# Altium project MTG_Bainarry_Main_PCB.PrjPcb
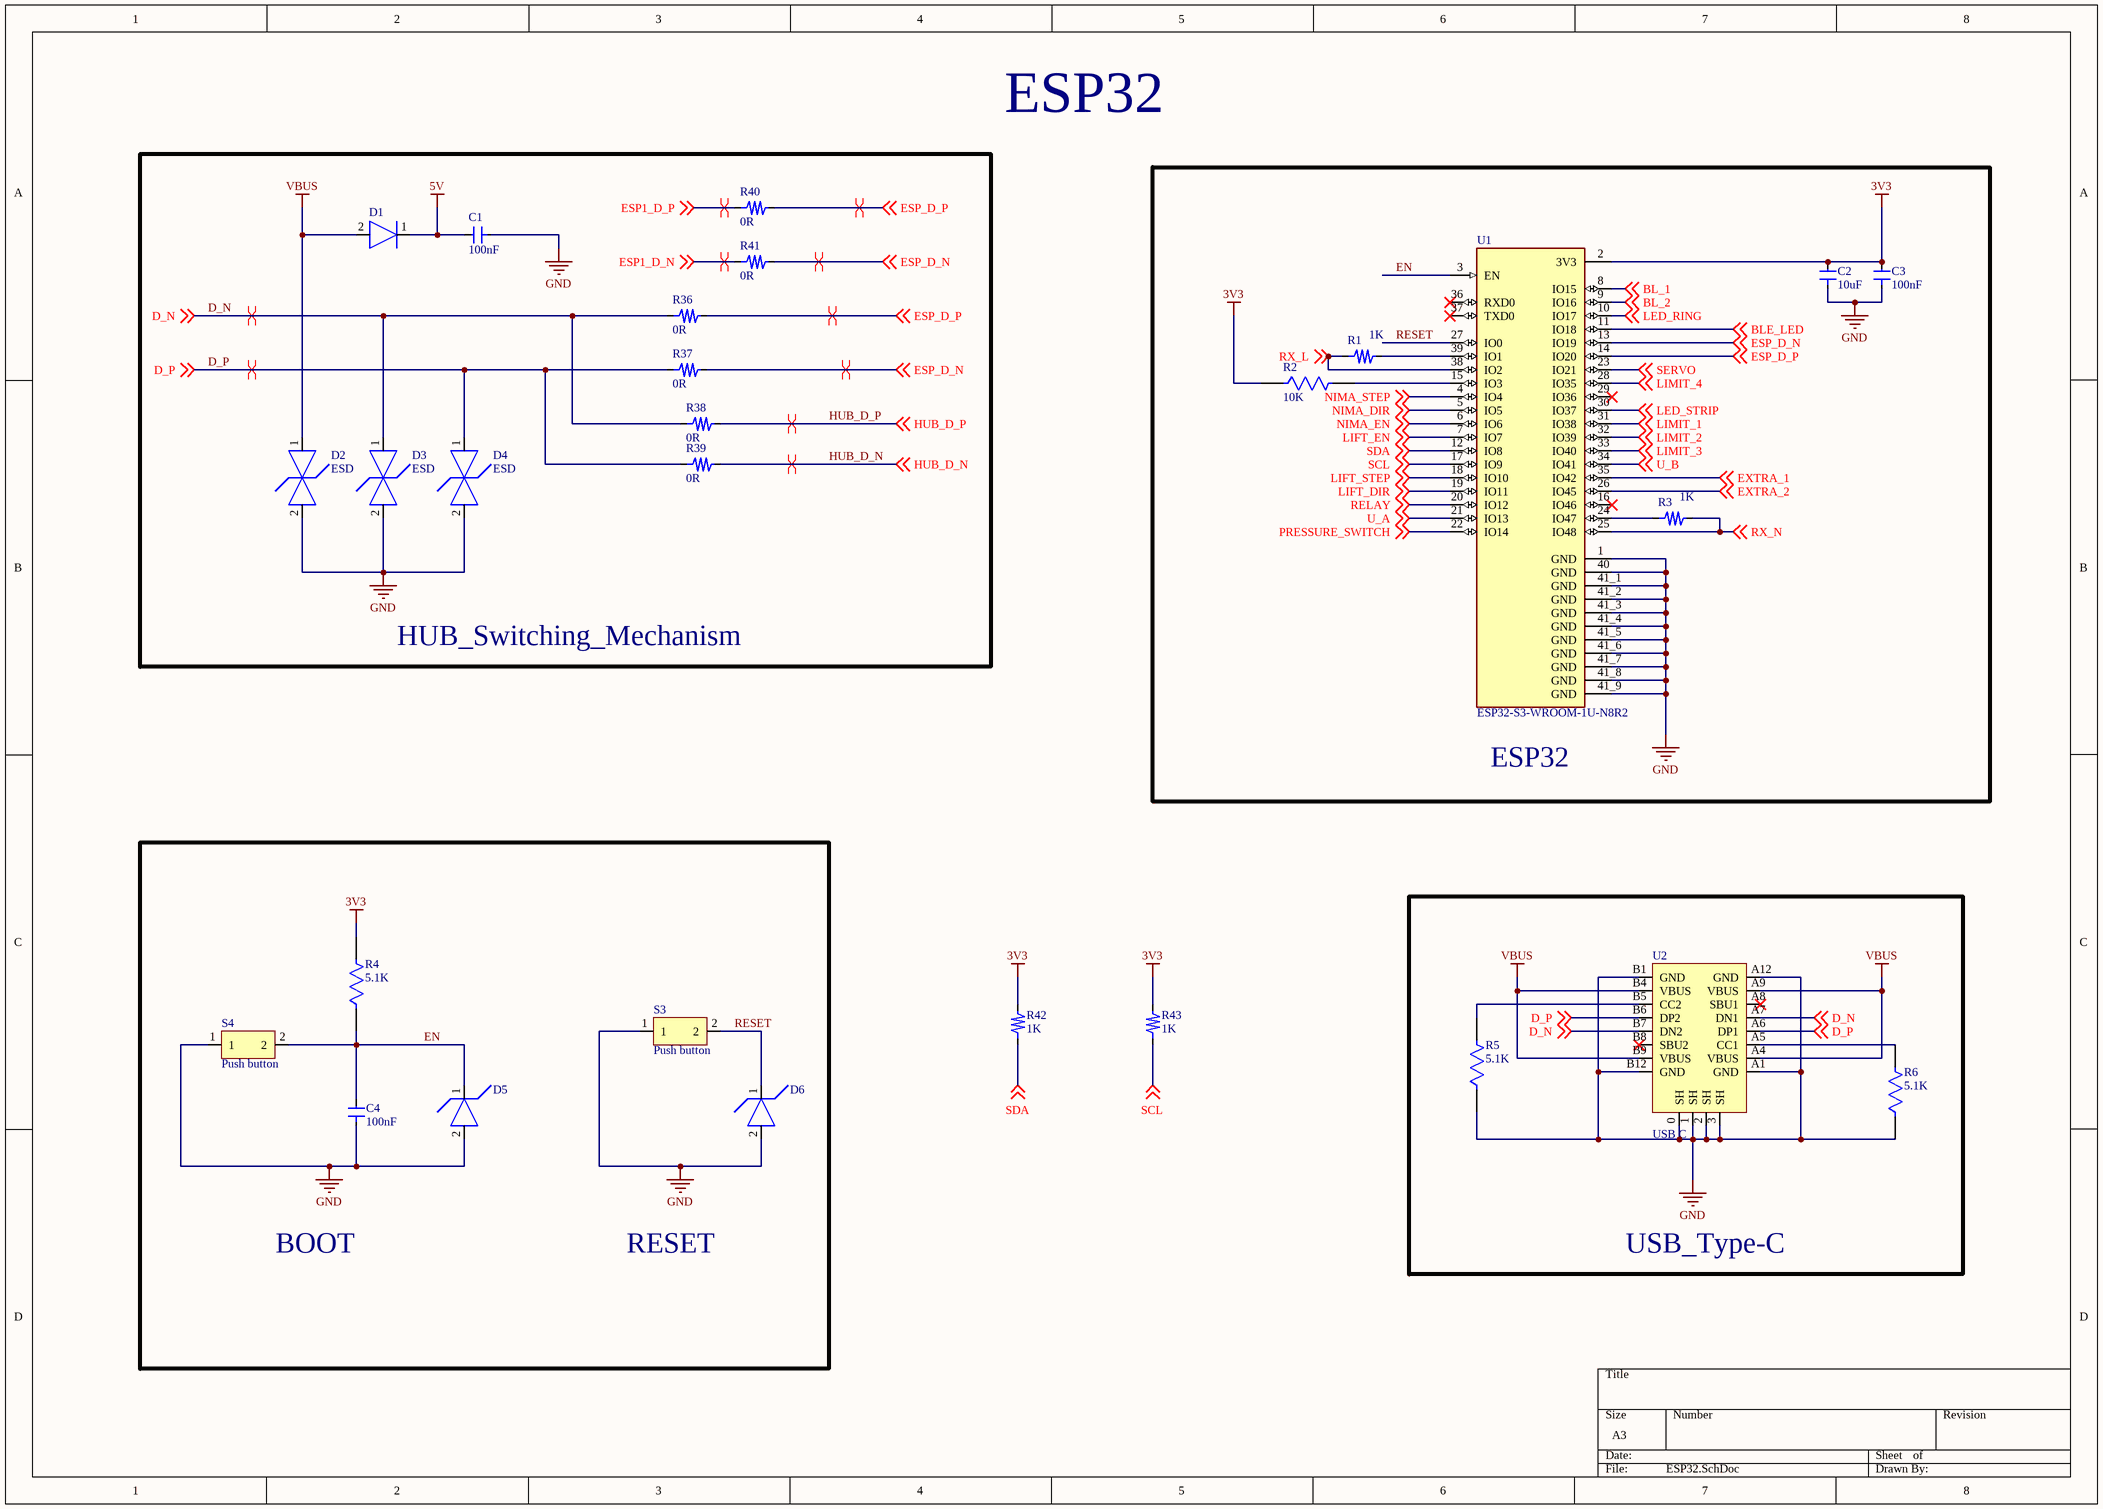
[diagram p0: ESP32.SchDoc]
7 sheets, 115 parts. Net scope: global (net labels, ports and power ports of the same name join across sheets).
Board file: MTG_B_MAIN.PcbDoc
Sheets:
  ESP32.SchDoc
  XIAO_S3.SchDoc
  MOTOR_DRIVERS.SchDoc
  USB_HUB.SchDoc
  REALY_AND_PRESSURE.SchDoc
  CONNECTORS.SchDoc
  Power.SchDoc

## Sheet ESP32.SchDoc
size A3; SheetNumber: 1; SheetTotal: 7

### Parts
C1  100nF  [CAP 0603]
C2  10uF  [CAP 0603]
C3  100nF  [CAP 0603]
C4  100nF  [CAP 0603]
D1  Diode  [Dioad]  (value not drawn)
D2  ESD  [ESD]
D3  ESD  [ESD]
D4  ESD  [ESD]
D5  SINGAL ESD  [Singal ESD]  (value not drawn)
D6  SINGAL ESD  [Singal ESD]  (value not drawn)
R1  1K  [RES 0603]
R2  10K  [RES 0603]
R3  1K  [RES 0603]
R4  5.1K  [RES 0603]
R5  5.1K  [RES 0603]
R6  5.1K  [RES 0603]
R36  0R  [RES_0201]
R37  0R  [RES_0201]
R38  0R  [RES_0201]
R39  0R  [RES_0201]
R40  0R  [RES_0201]
R41  0R  [RES_0201]
R42  1K  [RES 0603]
R43  1K  [RES 0603]
S3  Push button  [Tactical Switch]
S4  Push button  [Tactical Switch]
U1  ESP32-S3-WROOM-1U-N8R2  [XCVR_ESP32-S3-WROOM-1U-N8R2]
U2  USB C  [TYPE-C]

### Blocks framed on the sheet
HUB_Switching_Mechanism: C1 D1-D4 R36-R41
ESP32: C2 C3 R1-R3 U1
USB_Type-C: R5 R6 U2

### Nets
3V3: C2.2 C3.2 R2.1 R4.2 R42.2 R43.2 U1.2(3V3)
5V: C1.2 D1.1
GND: C1.1 C2.1 C3.1 C4.1 D2.2 D3.2 D4.2 D5.2 D6.2 R5.1 R6.1 S3.1 S4.1 U1.1(GND) U1.40(GND) U1.41_1(GND) U1.41_2(GND) U1.41_3(GND) U1.41_4(GND) U1.41_5(GND) U1.41_6(GND) U1.41_7(GND) U1.41_8(GND) U1.41_9(GND) U2.0(SH) U2.1(SH) U2.2(SH) U2.3(SH) U2.A1(GND) U2.A12(GND) U2.B1(GND) U2.B12(GND)
VBUS: D1.2 D2.1 U2.A4(VBUS) U2.A9(VBUS) U2.B4(VBUS) U2.B9(VBUS)
BL_1: U1.8(IO15) ; off-sheet BL_1
BL_2: U1.9(IO16) ; off-sheet BL_2
BLE_LED: U1.11(IO18) ; off-sheet BLE_LED
D_N: D3.1 R36.1 R38.1 U2.A7(DN1) U2.B7(DN2) ; off-sheet D_N
D_P: D4.1 R37.1 R39.1 U2.A6(DP1) U2.B6(DP2) ; off-sheet D_P
EN: C4.2 D5.1 R4.1 S4.2 U1.3(EN)
ESP1_D_N: R41.1 ; off-sheet ESP1_D_N
ESP1_D_P: R40.1 ; off-sheet ESP1_D_P
ESP_D_N: R37.2 R41.2 U1.13(IO19) ; off-sheet ESP_D_N
ESP_D_P: R36.2 R40.2 U1.14(IO20) ; off-sheet ESP_D_P
EXTRA_1: U1.35(IO42) ; off-sheet EXTRA_1
EXTRA_2: U1.26(IO45) ; off-sheet EXTRA_2
HUB_D_N: R39.2 ; off-sheet HUB_D_N
HUB_D_P: R38.2 ; off-sheet HUB_D_P
LED_RING: U1.10(IO17) ; off-sheet LED_RING
LED_STRIP: U1.30(IO37) ; off-sheet LED_STRIP
LIFT_DIR: U1.19(IO11) ; off-sheet LIFT_DIR
LIFT_EN: U1.7(IO7) ; off-sheet LIFT_EN
LIFT_STEP: U1.18(IO10) ; off-sheet LIFT_STEP
LIMIT_1: U1.31(IO38) ; off-sheet LIMIT_1
LIMIT_2: U1.32(IO39) ; off-sheet LIMIT_2
LIMIT_3: U1.33(IO40) ; off-sheet LIMIT_3
LIMIT_4: U1.28(IO35) ; off-sheet LIMIT_4
NIMA_DIR: U1.5(IO5) ; off-sheet NIMA_DIR
NIMA_EN: U1.6(IO6) ; off-sheet NIMA_EN
NIMA_STEP: U1.4(IO4) ; off-sheet NIMA_STEP
PRESSURE_SWITCH: U1.22(IO14) ; off-sheet PRESSURE_SWITCH
RELAY: U1.20(IO12) ; off-sheet RELAY
RESET: D6.1 S3.2 U1.27(IO0)
RX_L: R1.1 U1.38(IO2) ; off-sheet RX_L
RX_N: R3.2 U1.25(IO48) ; off-sheet RX_N
SCL: R43.1 U1.17(IO9) ; off-sheet SCL
SDA: R42.1 U1.12(IO8) ; off-sheet SDA
SERVO: U1.23(IO21) ; off-sheet SERVO
U_A: U1.21(IO13) ; off-sheet U_A
U_B: U1.34(IO41) ; off-sheet U_B
NetR1_2: R1.2 U1.39(IO1)
NetR2_2: R2.2 U1.15(IO3)
NetR3_1: R3.1 U1.24(IO47)
NetR5_2: R5.2 U2.B5(CC2)
NetR6_2: R6.2 U2.A5(CC1)

Not connected (* = marked no-connect by the designer): U1 16(IO46)* 29(IO36)* 36(RXD0)* 37(TXD0)*; U2 A8(SBU1)* B8(SBU2)*

### Layout directives
differential pair: D_N, D_P, ESP1_D_N, ESP1_D_P, ESP_D_N, ESP_D_P, HUB_D_N, HUB_D_P

### Notes on the sheet
- ESP32
- BOOT
- RESET

### Library data of the parts
C1 C3 C4 = Capasitor: Part Number: CC0603JRX7R9BB104; Manufacture: YAGEO; Footprint size: 0603; ComponentLink1Description: New link; ComponentLink1URL: *; Supplier: LCSC; Supplier Part Number: C91183; Link: https://www.lcsc.com/product-detail/C91183.html
C2 = Capasitor: Part Number: CC0603KRX5R5BB106; Manufacture: YAGEO; Footprint size: 0603; ComponentLink1Description: New link; ComponentLink1URL: *; Supplier: LCSC; Supplier Part Number: C109455; Link: https://www.lcsc.com/product-detail/C109455.html
D1 = Diode: Manufacture: Guangdong Hottech; Part Number: 1N5819WS; Footprint size: SOD-323; Supplier Part Number: C191023; Supplier: LCSC; Link: https://www.lcsc.com/product-detail/C191023.html?s_z=n_1N5819WS
D2-D4 = ESD: Manufacture: UMW; Part Number: LESD5D5.0CT1G(UMW); Footprint size: SOD-523; Supplier: LCSC; Supplier Part Number: C5199850; Link: https://www.lcsc.com/product-detail/C5199850.html?s_z=n_LESD5D5.0CT1G
D5 D6 = SINGAL ESD: Manufacture: onsemi; Part Number: ESD5Z3.3T1G; Footprint size: SOD-523; Supplier: LCSC; Supplier Part Number: C61148; Link: https://www.lcsc.com/product-detail/C61148.html?s_z=n_ESD5Z3.3T1G
R1 R3 = Resistor: Manufacture: RESI; Part Number: AECR0603F1K00K9; Footprint size: 0603; ComponentLink1Description: New link; ComponentLink1URL: *; Supplier: LCSC; Supplier Part Number: C328340; Link: https://www.lcsc.com/product-detail/C328340.html?spm=wm.fly.bg.0.xh&lcsc_vid=RFYMBlMFQAQLUVJeFVJZXwVeRFYIAgBXEVkPUlxRRVUxVlNRQFNWUFJUQFldUjsOAxUeFF5JWBYZEEoKFBINSQcJGk4eFQsCAgIaSgADAwAHC0slQllXU1RIHxUDCw%3D%3D
R2 = R NEW: Manufacture: YAGEO; Part Number: RC0603JR-0710KL; Footprint size: 0603; ComponentLink1Description: New link; ComponentLink1URL: *; Supplier: LCSC; Supplier Part Number: C99198; Link: https://www.lcsc.com/product-detail/C99198.html
R4-R6 = R NEW: Manufacture: YAGEO; Part Number: RC0603JR-075K1L; Footprint size: 0603; ComponentLink1Description: New link; ComponentLink1URL: *; Supplier: LCSC; Supplier Part Number: C14677; Link: https://www.lcsc.com/product-detail/C14677.html
R36-R41 = Resistor: Manufacture: YAGEO; Part Number: RC0201FR-070RL; Footprint size: 0201; ComponentLink1Description: New link; ComponentLink1URL: *; Supplier: LCSC; Supplier Part Number: C106227; Link: https://www.lcsc.com/product-detail/C106227.html?s_z=n_q_C106227
R42 R43 = Resistor: Manufacture: YAGEO; Part Number: RC0603FR-074K7L; Footprint size: 0603; ComponentLink1Description: New link; ComponentLink1URL: *; Supplier: LCSC; Supplier Part Number: C99782; Link: https://www.lcsc.com/product-detail/C99782.html?spm=wm.fly.bg.0.xh___wm.sxq.dhl.mly.12-6-1&lcsc_vid=RFYMBlMFQAQLUVJeFVJZXwVeRFYIAgBXEVkPUlxRRVUxVlNRT1NdV1xeQ1FZVzsOAxUeFF5JWBYZEEoKFBINSQcJGk4eFQsCAgIaSgADAwAHC0slQ1hbUldfWQkaCgg%3D
S3 S4 = Push button: Manufacture: G-Switch; Part Number: GT-TC060A-H025-L1S; Footprint size: SMD,6x3mm; Supplier: LCSC; Supplier Part Number: C7450623; Link: https://www.lcsc.com/product-detail/C7450623.html
U1 = ESP32-S3-WROOM-1U-N8R2: Bluetooth, WiFi 802.11b/g/n, Bluetooth v5.0 Transceiver Module 2.4GHz Antenna Not Included, U.FL Surface Mount; Manufacture: ESPRESSIF; Part Number: ESP32-S3-WROOM-1U-N8R2; Footprint size: SMD,19.2x18mm; Supplier: LCSC; Supplier Part Number: C3013944; Link: https://www.lcsc.com/product-detail/C3013944.html?s_z=n_q_ESP32-S3-WROOM-1U-N8R2&spm=wm.ssy.bg.0.xh&lcsc_vid=RFYMBlMFQAQLUVJeFVJZXwVeRFYIAgBXEVkPUlxRRVUxVlNRQFVaU1JRR1hdUzsOAxUeFF5JWBYZEEoKFBINSQcJGk4eFQsCAgIaSgADAwAHC0slQ1hbUldfWQkaCgg%3D
U2 = USB C: Manufacture: DEALON; Part Number: USB-TYPE-C-018; Footprint size: SMD; Supplier: LCSC; Supplier Part Number: C2927038; Link: https://www.lcsc.com/product-detail/C2927038.html?s_z=n_q_C2927038&globalKeyword=C2927038

## Sheet XIAO_S3.SchDoc
size A4; SheetNumber: 2; SheetTotal: 7
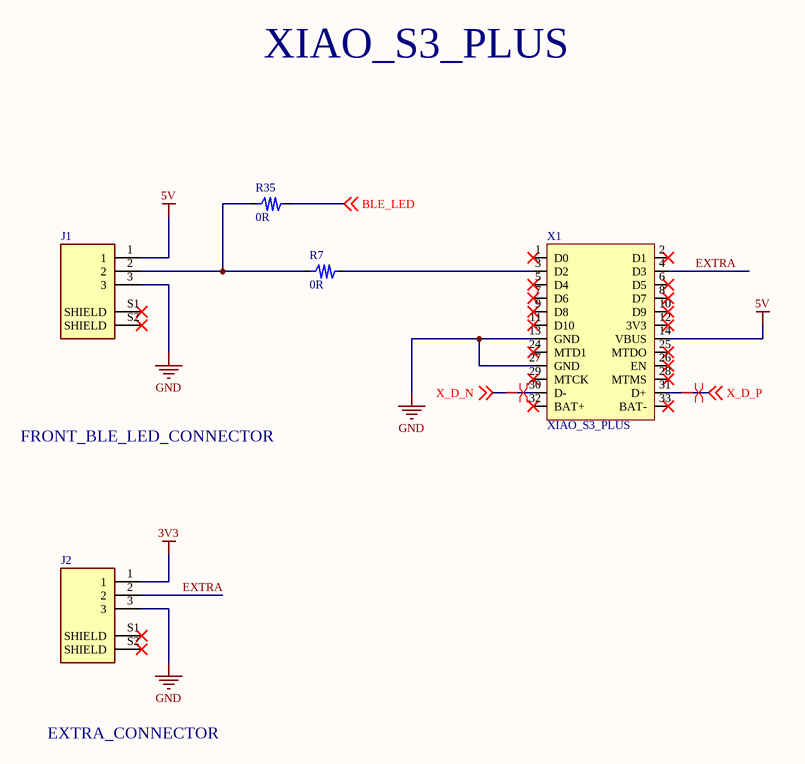
[diagram p1: XIAO_S3.SchDoc]

### Parts
J1  SM03B-SRSS-TB(LF)(SN)  [JST_SM03B-SRSS-TB(LF)(SN)]  (value not drawn)
J2  SM03B-SRSS-TB(LF)(SN)  [JST_SM03B-SRSS-TB(LF)(SN)]  (value not drawn)
R7  0R  [RES 0603]
R35  0R  [RES 0603]
X1  XIAO_S3_PLUS  [XIAO_S3_PLUS]

### Nets
3V3: J2.1
5V: J1.1 X1.14(VBUS)
GND: J1.3 J2.3 X1.13(GND) X1.27(GND)
BLE_LED: R35.2 ; off-sheet BLE_LED
EXTRA: J2.2 X1.4(D3)
X_D_N: X1.30(D-) ; off-sheet X_D_N
X_D_P: X1.31(D+) ; off-sheet X_D_P
NetJ1_2: J1.2 R7.1 R35.1
NetR7_2: R7.2 X1.3(D2)

Not connected (* = marked no-connect by the designer): J1 S1(SHIELD)* S2(SHIELD)*; J2 S1(SHIELD)* S2(SHIELD)*; X1 1(D0)* 2(D1)* 5(D4)* 6(D5)* 7(D6)* 8(D7)* 9(D8)* 10(D9)* 11(D10)* 12(3V3)* 24(MTD1)* 25(MTDO)* 26(EN)* 28(MTMS)* 29(MTCK)* 32(BAT+)* 33(BAT-)*

### Layout directives
differential pair: X_D_N, X_D_P

### Notes on the sheet
- XIAO_S3_PLUS
- FRONT_BLE_LED_CONNECTOR
- EXTRA_CONNECTOR

### Library data of the parts
J1 J2 = SM03B-SRSS-TB(LF)(SN): Connector Header Surface Mount, Right Angle 3 position 0.039 (1.00mm); Manufacture: JST; Part Number: SM03B-SRSS-TB(LF)(SN); Footprint size: SMD,P=1mm,Surface Mount,Right Angle; Supplier: LCSC; Supplier Part Number: C160403
  J1: Link: https://www.lcsc.com/product-detail/C160403.html?s_z=n_q_SM03B-SRSS-TB%2520%28LF%29%28SN%29&spm=wm.ssy.bg.0.xh&lcsc_vid=RFYMBlMFQAQLUVJeFVJZXwVeRFYIAgBXEVkPUlxRRVUxVlNRT1FYV1xXRVRYUjsOAxUeFF5JWBYZEEoKFBINSQcJGk4eFQsCAgIaSgADAwAHC0slRldeVFFSWQkaCgg%3D
  J2: Link: https://www.lcsc.com/product-detail/C160403.html?s_z=n_q_SM03B-SRSS-TB%2520%28LF%29%28SN%29&spm=wm.ssy.bg.0.xh&lcsc_vid=RFYMBlMFQAQLUVJeFVJZXwVeRFYIAgBXEVkPUlxRRVUxVlNRT1FbVVBSRFBeUjsOAxUeFF5JWBYZEEoKFBINSQcJGk4%3D
R7 R35 = Resistor: Manufacture: YAGEO; Part Number: RC0603JR-070RL; Footprint size: 0603; ComponentLink1Description: New link; ComponentLink1URL: *; Supplier: LCSC; Supplier Part Number: C95177; Link: https://www.lcsc.com/product-detail/C95177.html?spm=wm.fly.bg.0.xh___wm.sy.top.tjl.8-58&lcsc_vid=EwNbUgICTlRcBlxXEQRYAgYAFVkLVwZURVRZBVcDFVcxVlNRQVhdXlVXT1hfVjsOAxUeFF5JWBYZEEoBGA4JCwFIFA4DSA%3D%3D

## Sheet MOTOR_DRIVERS.SchDoc
size A4; SheetNumber: 3; SheetTotal: 7
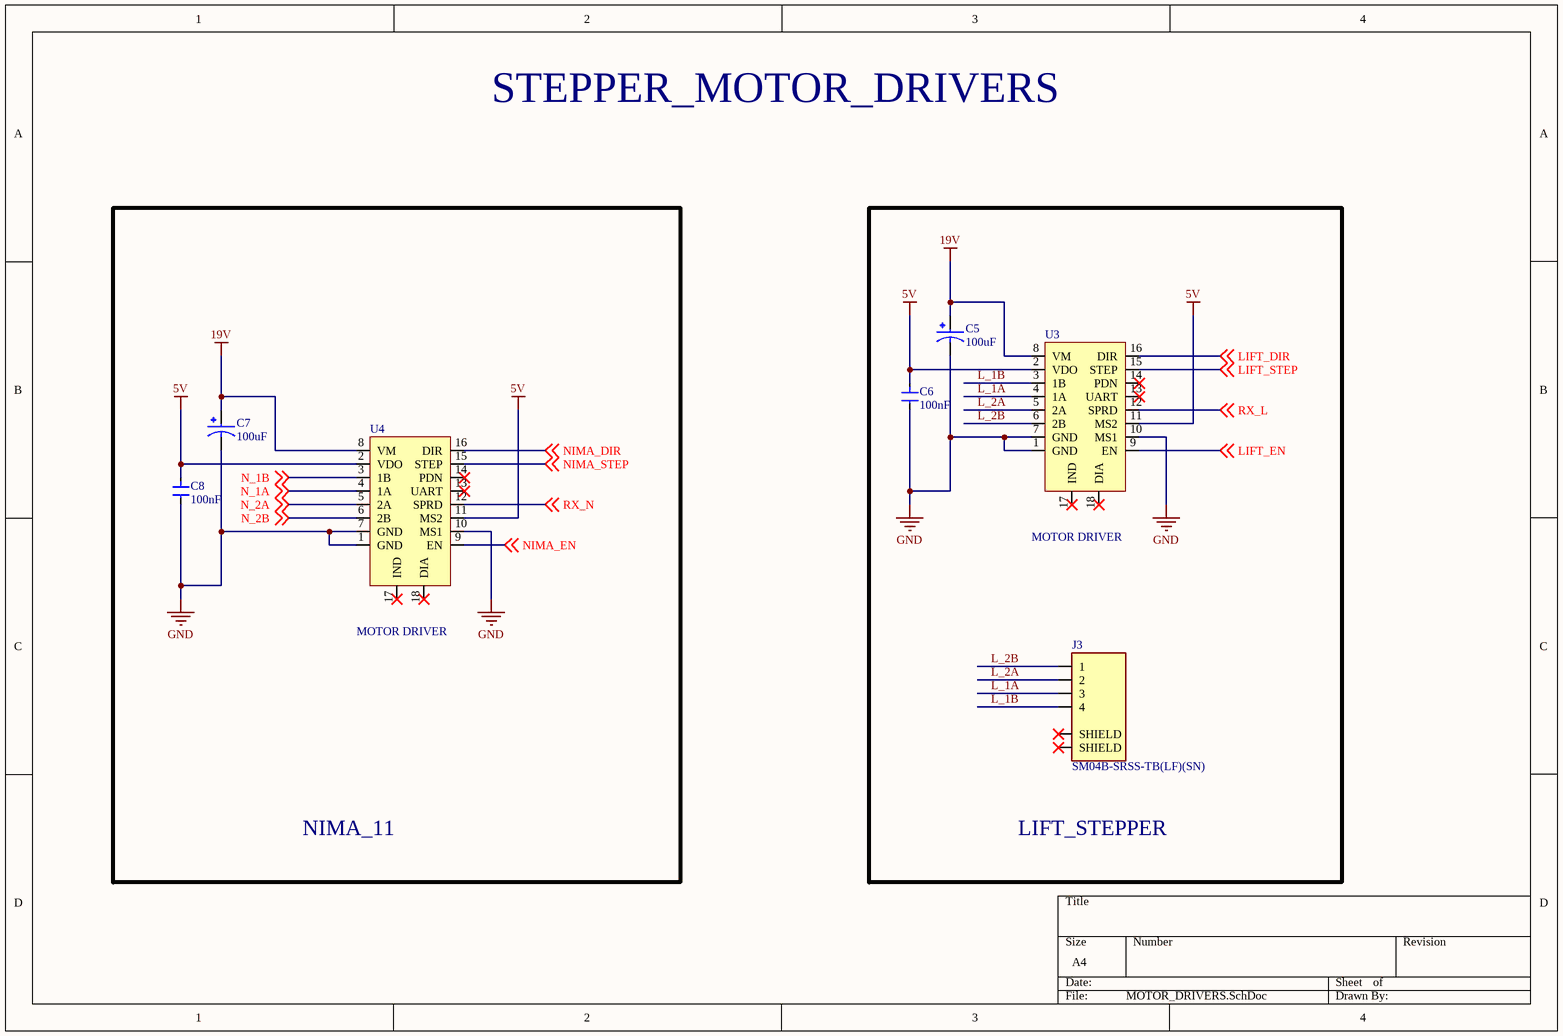
[diagram p2: MOTOR_DRIVERS.SchDoc]

### Parts
C5  100uF  [CAP_EEEFTH101XAP]
C6  100nF  [CAP 0603]
C7  100uF  [CAP_EEEFTH101XAP]
C8  100nF  [CAP 0603]
J3  SM04B-SRSS-TB(LF)(SN)  [CONN-TH_B4B-PH-K-S]
U3  MOTOR DRIVER  [MOTOR DRIVER]
U4  MOTOR DRIVER  [MOTOR DRIVER]

### Blocks framed on the sheet
NIMA_11: C7 C8 U4
LIFT_STEPPER: C5 C6 J3 U3

### Nets
5V: C6.1 C8.1 U3.2(VDO) U3.11(MS2) U4.2(VDO) U4.11(MS2)
19V: C5.1 C7.1 U3.8(VM) U4.8(VM)
GND: C5.2 C6.2 C7.2 C8.2 U3.1(GND) U3.7(GND) U3.10(MS1) U4.1(GND) U4.7(GND) U4.10(MS1)
L_1A: J3.3 U3.4(1A)
L_1B: J3.4 U3.3(1B)
L_2A: J3.2 U3.5(2A)
L_2B: J3.1 U3.6(2B)
LIFT_DIR: U3.16(DIR) ; off-sheet LIFT_DIR
LIFT_EN: U3.9(EN) ; off-sheet LIFT_EN
LIFT_STEP: U3.15(STEP) ; off-sheet LIFT_STEP
N_1A: U4.4(1A) ; off-sheet N_1A
N_1B: U4.3(1B) ; off-sheet N_1B
N_2A: U4.5(2A) ; off-sheet N_2A
N_2B: U4.6(2B) ; off-sheet N_2B
NIMA_DIR: U4.16(DIR) ; off-sheet NIMA_DIR
NIMA_EN: U4.9(EN) ; off-sheet NIMA_EN
NIMA_STEP: U4.15(STEP) ; off-sheet NIMA_STEP
RX_L: U3.12(SPRD) ; off-sheet RX_L
RX_N: U4.12(SPRD) ; off-sheet RX_N

Not connected (* = marked no-connect by the designer): J3 S1(SHIELD)* S2(SHIELD)*; U3 13(UART)* 14(PDN)* 17(IND)* 18(DIA)*; U4 13(UART)* 14(PDN)* 17(IND)* 18(DIA)*

### Notes on the sheet
- STEPPER_MOTOR_DRIVERS

### Library data of the parts
C5 C7 = EEEFTH101XAP: 100ÂµF 50V Aluminum Electrolytic Capacitors Radial, Can - SMD 340mOhm @ 100kHz 2000 Hrs @ 105Â°C; Manufacture: PANASONIC; Part Number: EEEFTH101XAP; Footprint size: SMD,D6.3xL7.7mm; Supplier: LCSC; Supplier Part Number: C165974; Link: https://www.lcsc.com/product-detail/C165974.html?spm=wm.fly.bg.0.xh___wm.fly.tp.1.ml&lcsc_vid=RFYMBlMFQAQLUVJeFVJZXwVeRFYIAgBXEVkPUlxRRVUxVlNRQVleUVNURlVfUDsOAxUeFF5JWBYZEEoKFBINSQcJGk4NBhADEA4cHktXRlVcSQwSGg0%3D
C6 C8 = Capasitor: as C1 on sheet ESP32; Footprint size: 0603; ComponentLink1Description: New link; ComponentLink1URL: *; Supplier: LCSC; Supplier Part Number: C91183; Link: https://www.lcsc.com/product-detail/C91183.html
J3 = SM04B-SRSS-TB(LF)(SN): Connector Header Surface Mount, Right Angle 4 position 0.039 (1.00mm); Manufacture: JST; Part Number: B4B-PH-K-S(LF)(SN); Footprint size: Through Hole,P=2mm; Supplier: LCSC; Supplier Part Number: C131334; Link: https://www.lcsc.com/product-detail/C131334.html?spm=wm.fly.bg.0.xh___wm.sxq.ssx.dcs.1&lcsc_vid=RFYMBlMFQAQLUVJeFVJZXwVeRFYIAgBXEVkPUlxRRVUxVlNRT1FbVVBSRFBeUjsOAxUeFF5JWBYZEEoKFBINSQcJGk4%3D

## Sheet USB_HUB.SchDoc
size A4; SheetNumber: 4; SheetTotal: 7
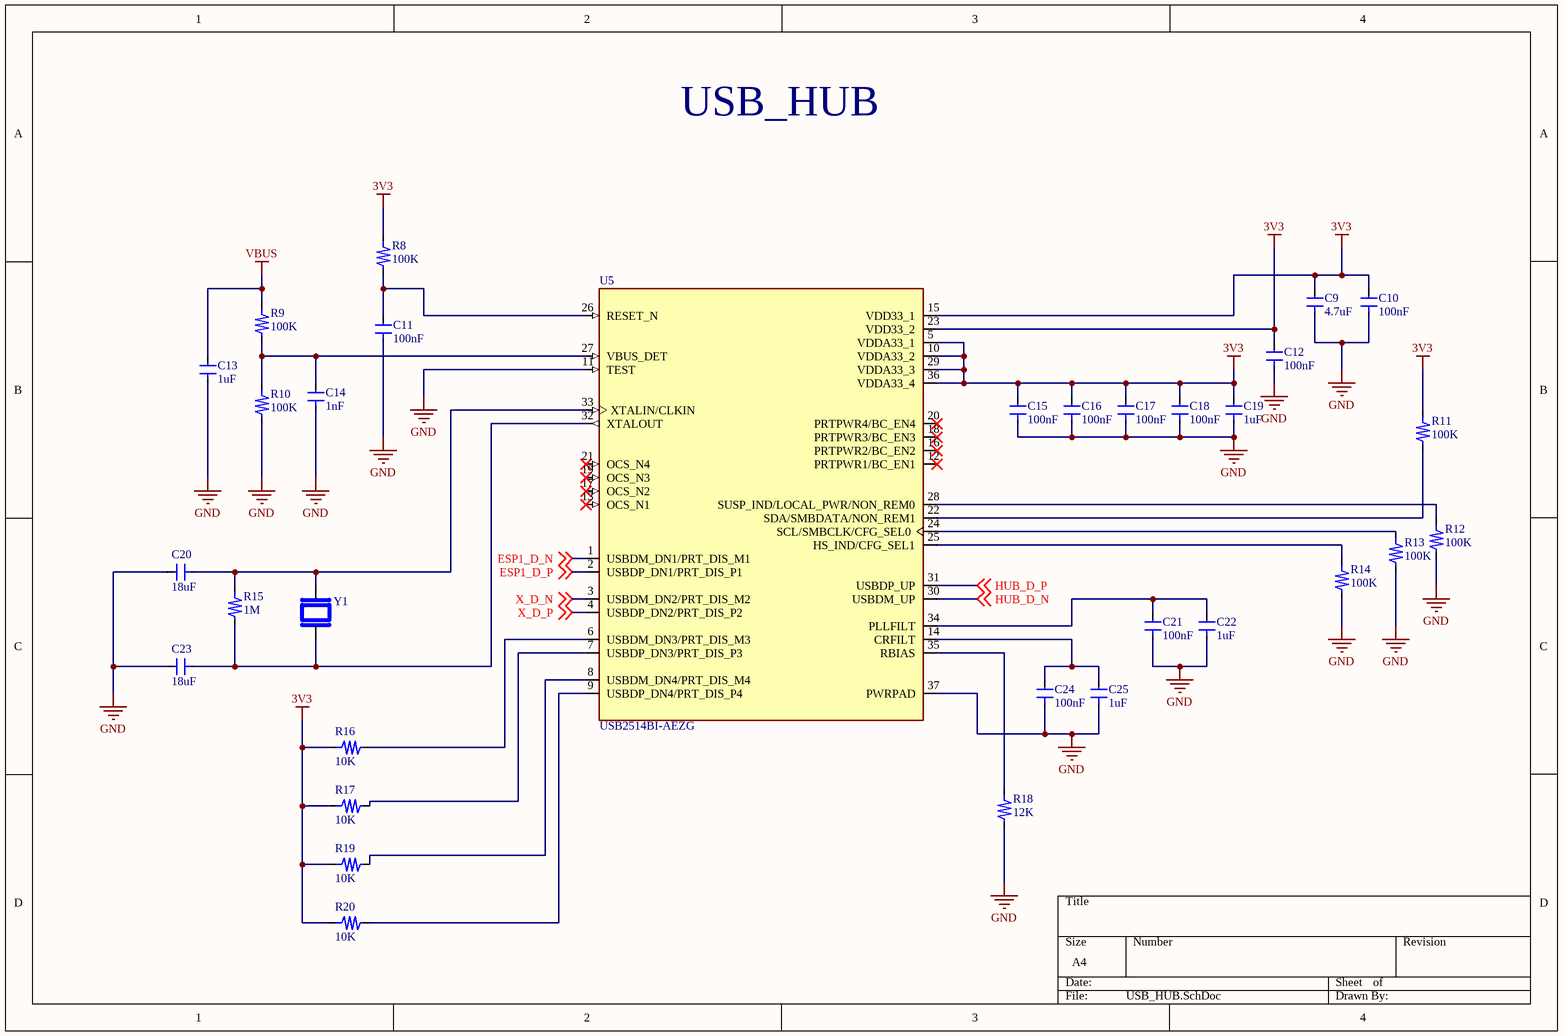
[diagram p3: USB_HUB.SchDoc]

### Parts
C9  4.7uF  [CAP 0603]
C10  100nF  [CAP 0603]
C11  100nF  [CAP 0603]
C12  100nF  [CAP 0603]
C13  1uF  [CAP 0603]
C14  1nF  [CAP 0603]
C15  100nF  [CAP 0603]
C16  100nF  [CAP 0603]
C17  100nF  [CAP 0603]
C18  100nF  [CAP 0603]
C19  1uF  [CAP 0603]
C20  18uF  [CAP 0603]
C21  100nF  [CAP 0603]
C22  1uF  [CAP 0603]
C23  18uF  [CAP 0603]
C24  100nF  [CAP 0603]
C25  1uF  [CAP 0603]
R8  100K  [RES 0603]
R9  100K  [RES 0603]
R10  100K  [RES 0603]
R11  100K  [RES 0603]
R12  100K  [RES 0603]
R13  100K  [RES 0603]
R14  100K  [RES 0603]
R15  1M  [RES 0603]
R16  10K  [RES 0603]
R17  10K  [RES 0603]
R18  12K  [RES 0603]
R19  10K  [RES 0603]
R20  10K  [RES 0603]
U5  USB2514BI-AEZG  [QFN50P600X600X100-37N]
Y1  ABLS-24.000MHZ-B4-T  [XTAL_ABLS-24.000MHZ-B4-T]  (value not drawn)

### Nets
3V3: C9.2 C10.2 C12.2 C15.2 C16.2 C17.2 C18.2 C19.2 R8.1 R11.1 R16.1 R17.1 R19.1 R20.1 U5.5(VDDA33_1) U5.10(VDDA33_2) U5.15(VDD33_1) U5.23(VDD33_2) U5.29(VDDA33_3) U5.36(VDDA33_4)
GND: C9.1 C10.1 C11.1 C12.1 C13.1 C14.1 C15.1 C16.1 C17.1 C18.1 C19.1 C20.2 C21.1 C22.1 C23.2 C24.1 C25.1 R10.2 R12.2 R13.2 R14.2 R18.2 U5.11(TEST) U5.37(PWRPAD)
VBUS: C13.2 R9.1
ESP1_D_N: U5.1(USBDM_DN1/PRT_DIS_M1) ; off-sheet ESP1_D_N
ESP1_D_P: U5.2(USBDP_DN1/PRT_DIS_P1) ; off-sheet ESP1_D_P
HUB_D_N: U5.30(USBDM_UP) ; off-sheet HUB_D_N
HUB_D_P: U5.31(USBDP_UP) ; off-sheet HUB_D_P
X_D_N: U5.3(USBDM_DN2/PRT_DIS_M2) ; off-sheet X_D_N
X_D_P: U5.4(USBDP_DN2/PRT_DIS_P2) ; off-sheet X_D_P
NetC11_2: C11.2 R8.2 U5.26(RESET_N)
NetC14_2: C14.2 R9.2 R10.1 U5.27(VBUS_DET)
NetC20_1: C20.1 R15.1 U5.33(XTALIN/CLKIN) Y1.2
NetC21_2: C21.2 C22.2 U5.34(PLLFILT)
NetC23_1: C23.1 R15.2 U5.32(XTALOUT) Y1.1
NetC24_2: C24.2 C25.2 U5.14(CRFILT)
NetR11_2: R11.2 U5.22(SDA/SMBDATA/NON_REM1)
NetR12_1: R12.1 U5.28(SUSP_IND/LOCAL_PWR/NON_REM0)
NetR13_1: R13.1 U5.24(SCL/SMBCLK/CFG_SEL0)
NetR14_1: R14.1 U5.25(HS_IND/CFG_SEL1)
NetR16_2: R16.2 U5.6(USBDM_DN3/PRT_DIS_M3)
NetR17_2: R17.2 U5.7(USBDP_DN3/PRT_DIS_P3)
NetR18_1: R18.1 U5.35(RBIAS)
NetR19_2: R19.2 U5.8(USBDM_DN4/PRT_DIS_M4)
NetR20_2: R20.2 U5.9(USBDP_DN4/PRT_DIS_P4)

Not connected (* = marked no-connect by the designer): U5 12(PRTPWR1/BC_EN1)* 13(OCS_N1)* 16(PRTPWR2/BC_EN2)* 17(OCS_N2)* 18(PRTPWR3/BC_EN3)* 19(OCS_N3)* 20(PRTPWR4/BC_EN4)* 21(OCS_N4)*

### Notes on the sheet
- USB_HUB

### Library data of the parts
C9 = Capasitor: Part Number: CL10A475KL8NRNC; Manufacture: Samsung Electro-Mechanics; Footprint size: 0603; ComponentLink1Description: New link; ComponentLink1URL: *; Supplier: LCSC; Supplier Part Number: C307467; Link: https://www.lcsc.com/product-detail/C307467.html?spm=wm.fly.bg.0.xh&lcsc_vid=RFYMBlMFQAQLUVJeFVJZXwVeRFYIAgBXEVkPUlxRRVUxVlNRQFNWU1xXQ1FYVTsOAxUeFF5JWBYZEEoKFBINSQcJGk4NBhADEA4cHktXRlVcSQwSGg0%3D
C10-C12 C15-C18 C21 C24 = Capasitor: as C1 on sheet ESP32; Footprint size: 0603; ComponentLink1Description: New link; ComponentLink1URL: *; Supplier: LCSC; Supplier Part Number: C91183; Link: https://www.lcsc.com/product-detail/C91183.html?spm=wm.fly.bg.0.xh&lcsc_vid=RFYMBlMFQAQLUVJeFVJZXwVeRFYIAgBXEVkPUlxRRVUxVlNRQFNZUlZTRldbXzsOAxUeFF5JWBYZEEoKFBINSQcJGk4NBhADEA4cHktXRlVcSQwSGg0%3D
C13 C19 C22 C25 = Capasitor: Part Number: CC0603JRX7R7BB105; Manufacture: YAGEO; Footprint size: 0603; ComponentLink1Description: New link; ComponentLink1URL: *; Supplier: LCSC; Supplier Part Number: C519560; Link: https://www.lcsc.com/product-detail/C519560.html?spm=wm.fly.bg.0.xh___wm.mly.mlk.28-0-4.ml&lcsc_vid=RFYMBlMFQAQLUVJeFVJZXwVeRFYIAgBXEVkPUlxRRVUxVlNRQFNYUlFWRVddVTsOAxUeFF5JWBYZEEoKFBINSQcJGk4dAgUUFAk%3D
C14 = Capasitor: Part Number: GRM1885C1H102JA01D; Manufacture: muRata; Footprint size: 0603; ComponentLink1Description: New link; ComponentLink1URL: *; Supplier: LCSC; Supplier Part Number: C77026; Link: https://www.lcsc.com/product-detail/C77026.html?spm=wm.fly.bg.0.xh&lcsc_vid=RFYMBlMFQAQLUVJeFVJZXwVeRFYIAgBXEVkPUlxRRVUxVlNRQFNZU1RTQVldUTsOAxUeFF5JWBYZEEoKFBINSQcJGk4NBhADEA4cHktXRlVcSQwSGg0%3D
C20 C23 = Capasitor: Part Number: CC0603FRNPO9BN180; Manufacture: YAGEO; Footprint size: 0603; ComponentLink1Description: New link; ComponentLink1URL: *; Supplier: LCSC; Supplier Part Number: C527046; Link: https://www.lcsc.com/product-detail/C527046.html?spm=wm.fly.bg.0.xh&lcsc_vid=RFYMBlMFQAQLUVJeFVJZXwVeRFYIAgBXEVkPUlxRRVUxVlNRQFNZUFBXRFNZUTsOAxUeFF5JWBYZEEoKFBINSQcJGk4NBhADEA4cHktXRlVcSQwSGg0%3D
R8-R14 = Resistor: Manufacture: FH; Part Number: RS-03K104JT; Footprint size: 0603; ComponentLink1Description: New link; ComponentLink1URL: *; Supplier: LCSC; Supplier Part Number: C73806; Link: https://www.lcsc.com/product-detail/C73806.html?spm=wm.fly.bg.0.xh___wm.mly.mlk.28-6-1.ml&lcsc_vid=RFYMBlMFQAQLUVJeFVJZXwVeRFYIAgBXEVkPUlxRRVUxVlNRQFNYUVZQRlheVDsOAxUeFF5JWBYZEEoKFBINSQcJGk4dAgUUFAk%3D
R15 = Resistor: Manufacture: FH; Part Number: RS-03K1004FT; Footprint size: 0603; ComponentLink1Description: New link; ComponentLink1URL: *; Supplier: LCSC; Supplier Part Number: C136593; Link: https://www.lcsc.com/product-detail/C136593.html?spm=wm.fly.bg.0.xh___wm.mly.mlk.28-6-1.ml&lcsc_vid=RFYMBlMFQAQLUVJeFVJZXwVeRFYIAgBXEVkPUlxRRVUxVlNRQFNYUVZQRlheVDsOAxUeFF5JWBYZEEoKFBINSQcJGk4dAgUUFAk%3D
R16 R17 R19 R20 = Resistor: Manufacture: FH; Part Number: RS-03K1002FT; Footprint size: 0603; ComponentLink1Description: New link; ComponentLink1URL: *; Supplier: LCSC; Supplier Part Number: C115324; Link: https://www.lcsc.com/product-detail/C115324.html?spm=wm.fly.bg.0.xh&lcsc_vid=RFYMBlMFQAQLUVJeFVJZXwVeRFYIAgBXEVkPUlxRRVUxVlNRQFNWVFZXQ1NWXjsOAxUeFF5JWBYZEEoKFBINSQcJGk4NBhADEA4cHktXRlhXSQwSGg0%3D
R18 = Resistor: Manufacture: FH; Part Number: RS-03K1202FT; Footprint size: 0603; ComponentLink1Description: New link; ComponentLink1URL: *; Supplier: LCSC; Supplier Part Number: C136587; Link: https://www.lcsc.com/product-detail/C136587.html?spm=wm.fly.bg.0.xh&lcsc_vid=RFYMBlMFQAQLUVJeFVJZXwVeRFYIAgBXEVkPUlxRRVUxVlNRQFNWV1FTRVJbVzsOAxUeFF5JWBYZEEoKFBINSQcJGk4NBhADEA4cHktXRlhXSQwSGg0%3D
U5 = USB2514BI-AEZG: USB Hub Controller USB 2.0 USB Interface 36-QFN (6x6); Manufacture: MICROCHIP; Part Number: USB2514BI-AEZG-TR; Footprint size: TQFN-36-EP(6x6); Supplier: LCSC; Supplier Part Number: C58940; Link: https://www.lcsc.com/product-detail/C58940.html?s_z=n_q_USB2514BI-AEZG-TR&spm=wm.fly.bg.0.xh&lcsc_vid=RFYMBlMFQAQLUVJeFVJZXwVeRFYIAgBXEVkPUlxRRVUxVlNRT1BZUlFWQ1JXUTsOAxUeFF5JWBYZEEoKFBINSQcJGk4eFQsCAgIaSgADAwAHC0slRVJXX1BIHxUDCw%3D%3D
Y1 = ABLS-24.000MHZ-B4-T: HC/49US (AT49) SMD LOW PROFILE CRYSTAL; Manufacture: ABRACON; Part Number: ABLS-24.000MHZ-B4-T; Footprint size: HC-49S-SMD; Supplier: LCSC; Supplier Part Number: C5122439; Link: https://www.lcsc.com/product-detail/C5122439.html?spm=wm.fly.bg.1.xh___wm.fly.tp.1.ml&lcsc_vid=RFYMBlMFQAQLUVJeFVJZXwVeRFYIAgBXEVkPUlxRRVUxVlNRQFNZUlZTRldbXzsOAxUeFF5JWBYZEEoKFBINSQcJGk4NBhADEA4cHktXRlVcSQwSGg0%3D

## Sheet REALY_AND_PRESSURE.SchDoc
size A4; SheetNumber: 5; SheetTotal: 7
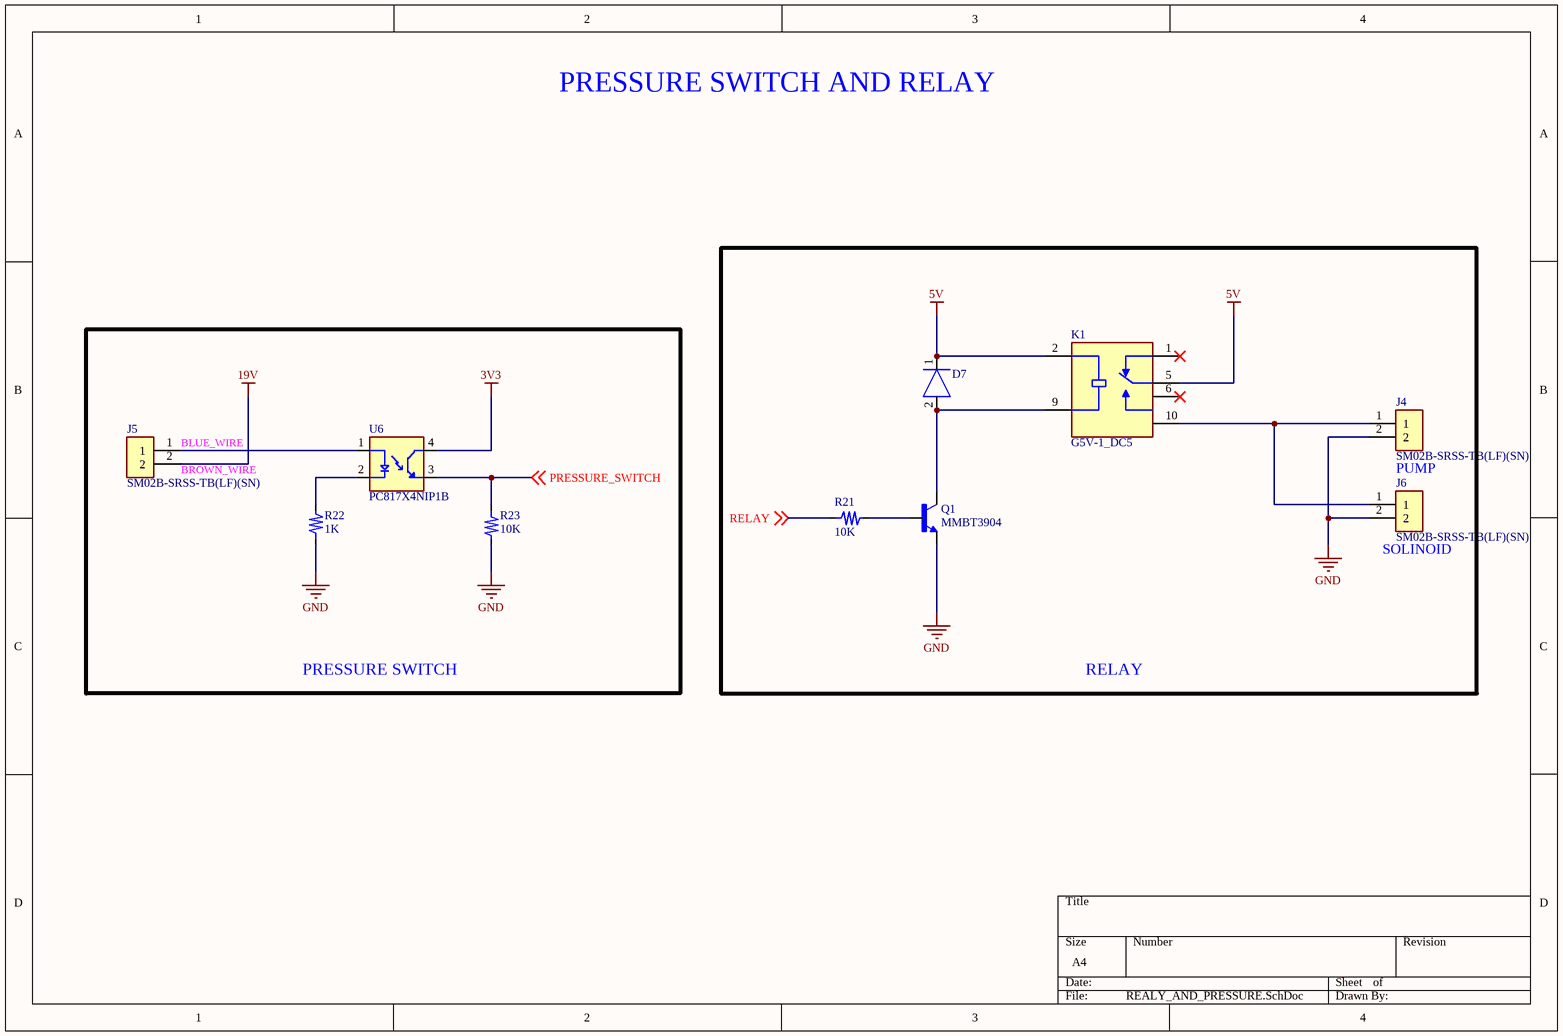
[diagram p4: REALY_AND_PRESSURE.SchDoc]

### Parts
D7  Diode  [RELAY DIODE]  (value not drawn)
J4  SM02B-SRSS-TB(LF)(SN)  [JST_BM02B-SRSS-TB(LF)(SN)]
J5  SM02B-SRSS-TB(LF)(SN)  [JST_BM02B-SRSS-TB(LF)(SN)]
J6  SM02B-SRSS-TB(LF)(SN)  [JST_BM02B-SRSS-TB(LF)(SN)]
K1  G5V-1_DC5  [RELAY_G5V-1_DC5]
Q1  MMBT3904  [TRANS_MMBT3904]
R21  10K  [RES 0603]
R22  1K  [RES 0603]
R23  10K  [RES 0603]
U6  PC817X4NIP1B  [SOIC254P960X420-4N]

### Blocks framed on the sheet
RELAY: D7 J4 J6 K1 Q1 R21
PRESSURE SWITCH: J5 R22 R23 U6

### Nets
3V3: U6.4(CT)
5V: D7.1 K1.2(COIL1) K1.5(COM)
19V: J5.2
GND: J4.2 J6.2 Q1.2(E) R22.1 R23.2
PRESSURE_SWITCH: R23.1 U6.3(ET) ; off-sheet PRESSURE_SWITCH
RELAY: R21.1 ; off-sheet RELAY
NetD7_2: D7.2 K1.9(COIL2) Q1.3(C)
NetJ4_1: J4.1 J6.1 K1.10(NO)
NetJ5_1: J5.1 U6.1(A)
NetQ1_1: Q1.1(B) R21.2
NetR22_2: R22.2 U6.2(C)

Not connected (* = marked no-connect by the designer): K1 1(NC)* 6(COM)*

### Notes on the sheet
- PRESSURE SWITCH AND RELAY
- (near J5) BLUE_WIRE
- (near J5) BROWN_WIRE
- PUMP
- (near J6) SOLINOID

### Library data of the parts
D7 = Diode: Manufacture: YONGYUTAI; Part Number: 1N4002; Footprint size: SMA; Supplier Part Number: C3038772; Supplier: LCSC; Link: https://www.lcsc.com/product-detail/C3038772.html?s_z=n_q_C3038772
J4-J6 = SM02B-SRSS-TB(LF)(SN): Connector Header Surface Mount, Right Angle 2 position 0.039 (1.00mm); Manufacture: JST; Part Number: BM02B-SRSS-TB(LF)(SN); Footprint size: SMD,P=1mm; Supplier: LCSC; Supplier Part Number: C160388; Link: https://www.lcsc.com/product-detail/C160388.html?s_z=n_q_BM02B-SRSS-TB%2520%28LF%29%28SN%29&spm=wm.ssy.bg.0.xh&lcsc_vid=RFYMBlMFQAQLUVJeFVJZXwVeRFYIAgBXEVkPUlxRRVUxVlNRQFVaV1JfRVBbXjsOAxUeFF5JWBYZEEoKFBINSQcJGk4%3D
K1 = G5V-1_DC5: General Purpose Relay SPDT (1 Form C) Through Hole; Manufacture: OMRON; Part Number: G5V-1 DC5; Footprint size: DIP,12.5x7.5mm; Supplier: LCSC; Supplier Part Number: C28695; Link: https://www.lcsc.com/product-detail/C28695.html?s_z=n_q_G5V-1%2520DC5&spm=wm.fly.bg.0.xh&lcsc_vid=RFYMBlMFQAQLUVJeFVJZXwVeRFYIAgBXEVkPUlxRRVUxVlNRT1BZUVdRTldWVDsOAxUeFF5JWBYZEEoKFBINSQcJGk4eFQsCAgIaSgADAwAHC0slRVFbVVJIHxUDCw%3D%3D
Q1 = MMBT3904: BJT, SOT-23, 40V, 200mA, NPN, 0.35W, 150Â°C; Manufacture: JSCJ; Part Number: MMBT3904(RANGE:100-300); Footprint size: SOT-23; Supplier: LCSC; Supplier Part Number: C20526; Link: https://www.lcsc.com/product-detail/C20526.html?s_z=n_q_C20526&globalKeyword=C20526
R21 R23 = Resistor: Manufacture: FH; Part Number: RS-03K103JT; Footprint size: 0603; ComponentLink1Description: New link; ComponentLink1URL: *; Supplier: LCSC; Supplier Part Number: C73809; Link: https://www.lcsc.com/product-detail/C73809.html?spm=wm.fly.bg.0.xh&lcsc_vid=RFYMBlMFQAQLUVJeFVJZXwVeRFYIAgBXEVkPUlxRRVUxVlNRQVlaVFJeTlRfVDsOAxUeFF5JWBYZEEoKFBINSQcJGk4NBhADEA4cHktXRlhXSQwSGg0%3D
R22 = Resistor: Manufacture: FH; Part Number: RS-03K102JT; Footprint size: 0603; ComponentLink1Description: New link; ComponentLink1URL: *; Supplier: LCSC; Supplier Part Number: C73797; Link: https://www.lcsc.com/product-detail/C73797.html?spm=wm.fly.bg.0.xh&lcsc_vid=RFYMBlMFQAQLUVJeFVJZXwVeRFYIAgBXEVkPUlxRRVUxVlNRQVlaVFFSQ1NWVjsOAxUeFF5JWBYZEEoKFBINSQcJGk4NBhADEA4cHktXRlhXSQwSGg0%3D
U6 = PC817X4NIP1B: Optocoupler DC-IN 1-CH Transistor DC-OUT 4-Pin DIP SMD T/R; Manufacture: SHARP; Part Number: PC817X3NIP1B; Footprint size: SMD-4P; Supplier: LCSC; Supplier Part Number: C169111; Link: https://www.lcsc.com/product-detail/C169111.html?s_z=n_q_PC817X4NIP1B&spm=wm.ssy.bg.0.xh&lcsc_vid=RFYMBlMFQAQLUVJeFVJZXwVeRFYIAgBXEVkPUlxRRVUxVlNRQVlaUVBVRVJZXzsOAxUeFF5JWBYZEEoKFBINSQcJGk4eFQsCAgIaSgADAwAHC0slRlBWVF1SWQkaCgg%3D

## Sheet CONNECTORS.SchDoc
size A4; SheetNumber: 6; SheetTotal: 7
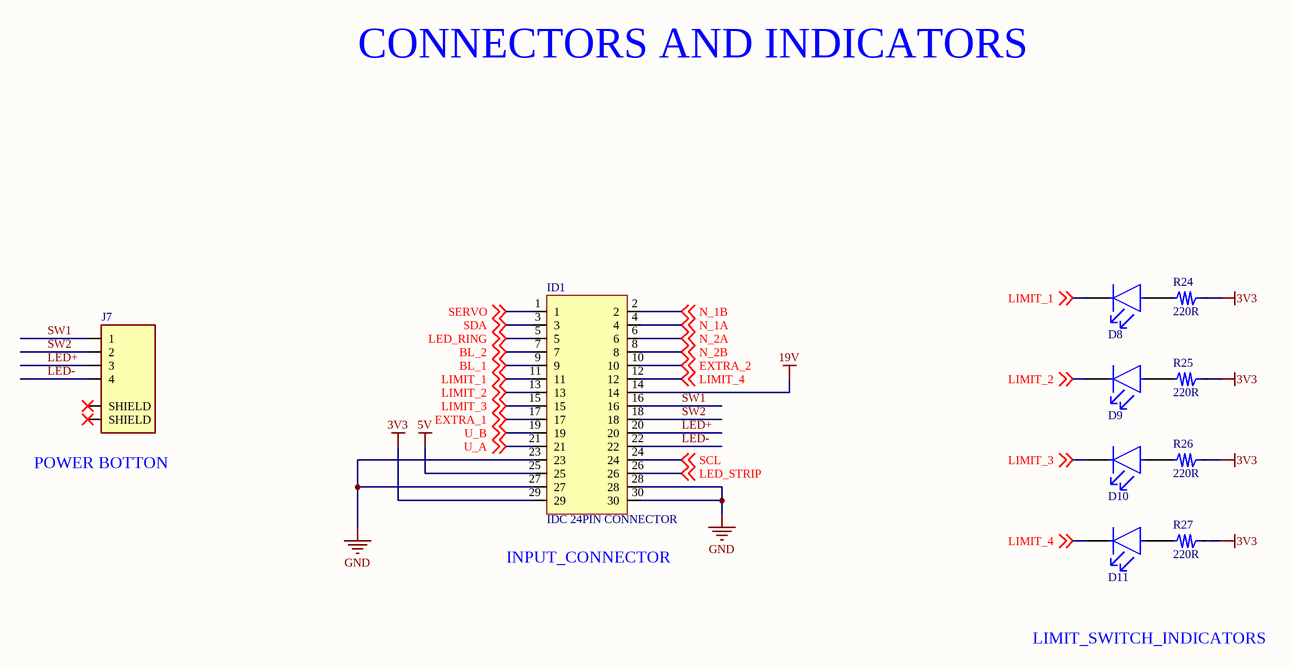
[diagram p5: CONNECTORS.SchDoc]

### Parts
D8  LED  [LED]  (value not drawn)
D9  LED  [LED]  (value not drawn)
D10  LED  [LED]  (value not drawn)
D11  LED  [LED]  (value not drawn)
ID1  IDC 24PIN CONNECTOR  [IDC 30 PIN]
J7  SM04B-SRSS-TB(LF)(SN)  [JST_SM04B-SRSS-TB(LF)(SN)]  (value not drawn)
R24  220R  [RES 0603]
R25  220R  [RES 0603]
R26  220R  [RES 0603]
R27  220R  [RES 0603]

### Nets
3V3: ID1.29 R24.1 R25.1 R26.1 R27.1
5V: ID1.25
19V: ID1.14
GND: ID1.23 ID1.27 ID1.28 ID1.30
BL_1: ID1.9 ; off-sheet BL_1
BL_2: ID1.7 ; off-sheet BL_2
EXTRA_1: ID1.17 ; off-sheet EXTRA_1
EXTRA_2: ID1.10 ; off-sheet EXTRA_2
LED+: ID1.20 J7.3
LED-: ID1.22 J7.4
LED_RING: ID1.5 ; off-sheet LED_RING
LED_STRIP: ID1.26 ; off-sheet LED_STRIP
LIMIT_1: D8.1(C) ID1.11 ; off-sheet LIMIT_1
LIMIT_2: D9.1(C) ID1.13 ; off-sheet LIMIT_2
LIMIT_3: D10.1(C) ID1.15 ; off-sheet LIMIT_3
LIMIT_4: D11.1(C) ID1.12 ; off-sheet LIMIT_4
N_1A: ID1.4 ; off-sheet N_1A
N_1B: ID1.2 ; off-sheet N_1B
N_2A: ID1.6 ; off-sheet N_2A
N_2B: ID1.8 ; off-sheet N_2B
SCL: ID1.24 ; off-sheet SCL
SDA: ID1.3 ; off-sheet SDA
SERVO: ID1.1 ; off-sheet SERVO
SW1: ID1.16 J7.1
SW2: ID1.18 J7.2
U_A: ID1.21 ; off-sheet U_A
U_B: ID1.19 ; off-sheet U_B
NetD8_2: D8.2(A) R24.2
NetD9_2: D9.2(A) R25.2
NetD10_2: D10.2(A) R26.2
NetD11_2: D11.2(A) R27.2

Not connected (* = marked no-connect by the designer): J7 S1(SHIELD)* S2(SHIELD)*

### Notes on the sheet
- CONNECTORS AND INDICATORS
- (near J7) POWER BOTTON
- (near ID1) INPUT_CONNECTOR
- LIMIT_SWITCH_INDICATORS

### Library data of the parts
D8-D11 = LED: Manufacture: XINGLIGHT; Part Number: XL-2012SURC; Footprint size: 0805; ComponentLink1Description: New link; ComponentLink1URL: *; Supplier: LCSC; Supplier Part Number: C965812; Link: https://www.lcsc.com/product-detail/C965812.html?s_z=n_XL-2012SURC
ID1 = IDC 24PIN CONNECTOR: Manufacture: Megastar; Part Number: ZX-IDC2.54-2-15PZZ; Footprint size: Through Hole,P=2.54mm; Supplier: LCSC; Supplier Part Number: C7501248; Link: https://www.lcsc.com/product-detail/C7501248.html?spm=wm.fly.bg.1.xh___wm.sxq.ssx.dcs.1&lcsc_vid=RFYMBlMFQAQLUVJeFVJZXwVeRFYIAgBXEVkPUlxRRVUxVlNRQFRdUlNRR1daVzsOAxUeFF5JWBYZEEoBGA4JCwFIFA4DSA%3D%3D
J7 = SM04B-SRSS-TB(LF)(SN): Connector Header Surface Mount, Right Angle 4 position 0.039 (1.00mm); Manufacture: JST; Part Number: SM04B-SRSS-TB(LF)(SN); Footprint size: SMD,P=1mm,Surface Mount,Right Angle; Supplier: LCSC; Supplier Part Number: C160404; Link: https://www.lcsc.com/product-detail/C160404.html?s_z=n_q_SM04B-SRSS-TB%28LF%29%28SN%29&spm=wm.ssy.bg.0.xh&lcsc_vid=RFYMBlMFQAQLUVJeFVJZXwVeRFYIAgBXEVkPUlxRRVUxVlNRQVlZVVBSQVVXUzsOAxUeFF5JWBYZEEoKFBINSQcJGk4%3D
R24-R27 = Resistor: Manufacture: YAGEO; Part Number: RC0603JR-07220RL; Footprint size: 0603; ComponentLink1Description: New link; ComponentLink1URL: *; Supplier: LCSC; Supplier Part Number: C114683; Link: https://www.lcsc.com/product-detail/C114683.html

## Sheet Power.SchDoc
size A4; SheetNumber: 7; SheetTotal: 7
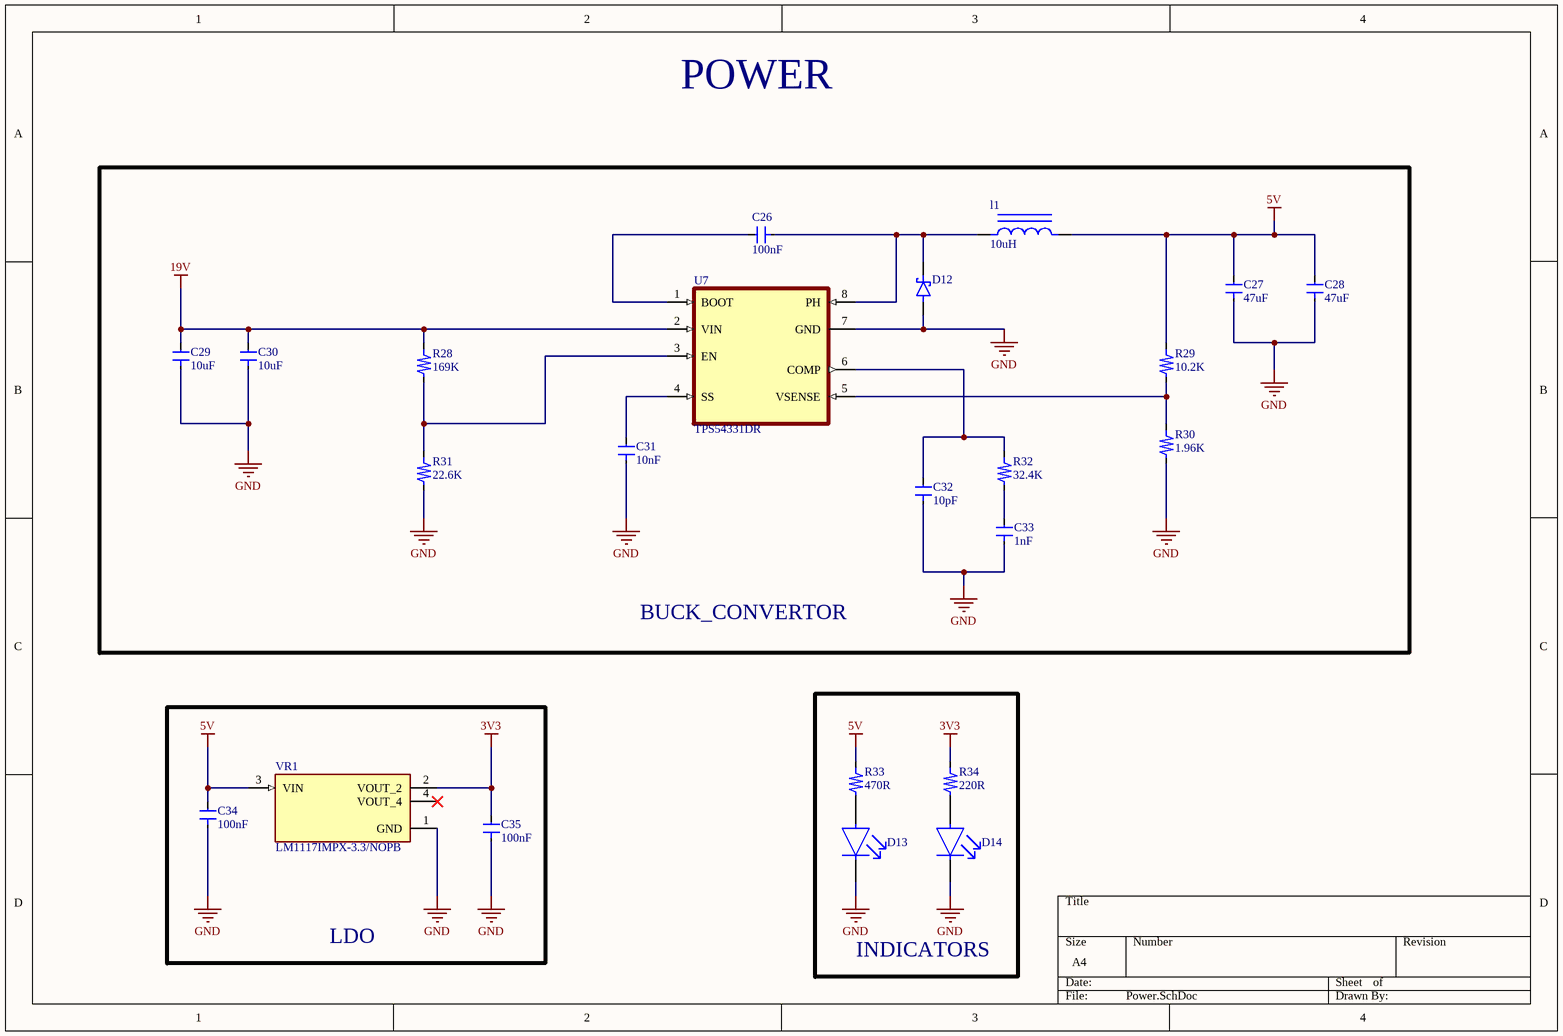
[diagram p6: Power.SchDoc]

### Parts
C26  100nF  [CAP 0603]
C27  47uF  [CAP 0603]
C28  47uF  [CAP 0603]
C29  10uF  [CAP 0805]
C30  10uF  [CAP 0805]
C31  10nF  [CAP 0603]
C32  10pF  [CAP 0603]
C33  1nF  [CAP 0603]
C34  100nF  [CAP 0603]
C35  100nF  [CAP 0603]
D12  B340A-E3/61T  [DIOM5126X229N]  (value not drawn)
D13  LED  [LED]  (value not drawn)
D14  LED  [LED]  (value not drawn)
l1  10uH  [INDUCTOR]
R28  169K  [RES 0603]
R29  10.2K  [RES 0603]
R30  1.96K  [RES 0603]
R31  22.6K  [RES 0603]
R32  32.4K  [RES 0603]
R33  470R  [RES 0603]
R34  220R  [RES 0603]
U7  TPS54331DR  [SOIC127P599X175-8N]
VR1  LM1117IMPX-3.3/NOPB  [VREG_LM1117IMPX-3.3/NOPB]

### Blocks framed on the sheet
BUCK_CONVERTOR: C26-C33 D12 l1 R28-R32 U7
LDO: C34 C35 VR1
INDICATORS: D13 D14 R33 R34

### Nets
3V3: C35.2 R34.1 VR1.2(VOUT_2)
5V: C27.2 C28.2 C34.2 l1.2 R29.1 R33.1 VR1.3(VIN)
19V: C29.2 C30.2 R28.1 U7.2(VIN)
GND: C27.1 C28.1 C29.1 C30.1 C31.1 C32.1 C33.1 C34.1 C35.1 D12.A D13.1(C) D14.1(C) R30.2 R31.2 U7.7(GND) VR1.1(GND)
NetC26_1: C26.1 D12.C l1.1 U7.8(PH)
NetC26_2: C26.2 U7.1(BOOT)
NetC31_2: C31.2 U7.4(SS)
NetC32_2: C32.2 R32.1 U7.6(COMP)
NetC33_2: C33.2 R32.2
NetD13_2: D13.2(A) R33.2
NetD14_2: D14.2(A) R34.2
NetR28_2: R28.2 R31.1 U7.3(EN)
NetR29_2: R29.2 R30.1 U7.5(VSENSE)

Not connected (* = marked no-connect by the designer): VR1 4(VOUT_4)*

### Notes on the sheet
- POWER

### Library data of the parts
C26 C34 C35 = Capasitor: as C1 on sheet ESP32; Footprint size: 0603; ComponentLink1Description: New link; ComponentLink1URL: *; Supplier: LCSC; Supplier Part Number: C91183; Link: https://www.lcsc.com/product-detail/C91183.html
C27 C28 = Capasitor: Part Number: GRM188R60J476ME15D; Manufacture: muRata; Footprint size: 0603; ComponentLink1Description: New link; ComponentLink1URL: *; Supplier: LCSC; Supplier Part Number: C140782; Link: https://www.lcsc.com/product-detail/C140782.html?spm=wm.fly.bg.0.xh&lcsc_vid=EwNbUgICTlRcBlxXEQRYAgYAFVkLVwZURVRZBVcDFVcxVlNRQVZbUlVUQ1BaVDsOAxUeFF5JWBYZEEoKFBINSQcJGk4NBhADEA4cHktXRlVcSQwSGg0%3D
C29 C30 = Capasitor: Part Number: GRM21BR61H106KE43L; Manufacture: muRata; Footprint size: 0805; ComponentLink1Description: New link; ComponentLink1URL: *; Supplier: LCSC; Supplier Part Number: C440198; Link: https://www.lcsc.com/product-detail/C440198.html?spm=wm.fly.bg.0.xh___wm.sy.dhl.mly.12-0-4&lcsc_vid=EwNbUgICTlRcBlxXEQRYAgYAFVkLVwZURVRZBVcDFVcxVlNRQVZbVl1eT1ddXzsOAxUeFF5JWBYZEEoBGA4JCwFIFA4DSA%3D%3D
C31 = Capasitor: Part Number: CC0603JRX7R9BB103; Manufacture: YAGEO; Footprint size: 0603; ComponentLink1Description: New link; ComponentLink1URL: *; Supplier: LCSC; Supplier Part Number: C115056; Link: https://www.lcsc.com/product-detail/C115056.html?spm=wm.fly.bg.0.xh___wm.sxq.ssx.dcs.1&lcsc_vid=EwNbUgICTlRcBlxXEQRYAgYAFVkLVwZURVRZBVcDFVcxVlNRQVZbVV1VQ1VZVTsOAxUeFF5JWBYZEEoKFBINSQcJGk4NBhADEA4cHktXRlVcSQwSGg0%3D
C32 = Capasitor: Part Number: GRM1885C1H100FA01D; Manufacture: muRata; Footprint size: 0603; ComponentLink1Description: New link; ComponentLink1URL: *; Supplier: LCSC; Supplier Part Number: C162202; Link: https://www.lcsc.com/product-detail/C162202.html?spm=wm.fly.bg.0.xh&lcsc_vid=EwNbUgICTlRcBlxXEQRYAgYAFVkLVwZURVRZBVcDFVcxVlNRQVZbU11QRVlbVzsOAxUeFF5JWBYZEEoKFBINSQcJGk4NBhADEA4cHktXRlVcSQwSGg0%3D
C33 = Capasitor: Part Number: GRM1885C1H102FA01D; Manufacture: muRata; Footprint size: 0603; ComponentLink1Description: New link; ComponentLink1URL: *; Supplier: LCSC; Supplier Part Number: C913702; Link: https://www.lcsc.com/product-detail/C913702.html?spm=wm.fly.bg.0.xh&lcsc_vid=EwNbUgICTlRcBlxXEQRYAgYAFVkLVwZURVRZBVcDFVcxVlNRQVZbU1xWRlhcUDsOAxUeFF5JWBYZEEoKFBINSQcJGk4NBhADEA4cHktXRlVcSQwSGg0%3D
D12 = B340A-E3/61T: Diode Schottky 40 V 3A Surface Mount DO-214AC (SMA); Manufacture: VISHAY; Part Number: B340A-E3/61T; Footprint size: SMA(DO-214AC); Supplier: LCSC; Supplier Part Number: C15570; Link: https://www.lcsc.com/product-detail/C15570.html?s_z=n_q_B340A-E3%252F61T&spm=wm.ssy.bg.0.xh&lcsc_vid=RFYMBlMFQAQLUVJeFVJZXwVeRFYIAgBXEVkPUlxRRVUxVlNRQVZaVFVTRFJeXzsOAxUeFF5JWBYZEEoKFBINSQcJGk4%3D
D13 D14 = LED: as D8 on sheet CONNECTORS; Footprint size: 0805; ComponentLink1Description: New link; ComponentLink1URL: *; Supplier: LCSC; Supplier Part Number: C965812; Link: https://www.lcsc.com/product-detail/C965812.html?s_z=n_XL-2012SURC
l1 = Iductor: Manufacture: YJYCOIN; Part Number: YPRH8D43-100M; Footprint size: SMD,8x8mm; ComponentLink1Description: New link; ComponentLink1URL: *; Supplier: LCSC; Supplier Part Number: C338825; Link: https://www.lcsc.com/product-detail/C338825.html?spm=wm.fly.bg.0.xh___wm.sy.top.tjl.8-42&lcsc_vid=EwNbUgICTlRcBlxXEQRYAgYAFVkLVwZURVRZBVcDFVcxVlNRQVZaUFVXRFFYXzsOAxUeFF5JWBYZEEoBGA4JCwFIFA4DSA%3D%3D
R28 = Resistor: Manufacture: Viking; Part Number: AR03FTC1693; Footprint size: 0603; ComponentLink1Description: New link; ComponentLink1URL: *; Supplier: LCSC; Supplier Part Number: C234308; Link: https://www.lcsc.com/product-detail/C234308.html?spm=wm.fly.bg.0.xh___wm.sy.top.tjl.8-58&lcsc_vid=EwNbUgICTlRcBlxXEQRYAgYAFVkLVwZURVRZBVcDFVcxVlNRQVZbVVZVQFVdUjsOAxUeFF5JWBYZEEoBGA4JCwFIFA4DSA%3D%3D
R29 = Resistor: Manufacture: FH; Part Number: RS-03K1022FT; Footprint size: 0603; ComponentLink1Description: New link; ComponentLink1URL: *; Supplier: LCSC; Supplier Part Number: C321670; Link: https://www.lcsc.com/product-detail/C321670.html?spm=wm.fly.bg.0.xh&lcsc_vid=EwNbUgICTlRcBlxXEQRYAgYAFVkLVwZURVRZBVcDFVcxVlNRQVZbVFNfTlZfUzsOAxUeFF5JWBYZEEoKFBINSQcJGk4NBhADEA4cHktXRlhXSQwSGg0%3D
R30 = Resistor: Manufacture: FOJAN; Part Number: FRC0603F1961TS; Footprint size: 0603; ComponentLink1Description: New link; ComponentLink1URL: *; Supplier: LCSC; Supplier Part Number: C2998107; Link: https://www.lcsc.com/product-detail/C2998107.html?spm=wm.fly.bg.1.xh&lcsc_vid=EwNbUgICTlRcBlxXEQRYAgYAFVkLVwZURVRZBVcDFVcxVlNRQVZbVF1eT1JZUjsOAxUeFF5JWBYZEEoKFBINSQcJGk4NBhADEA4cHktXRlhXSQwSGg0%3D
R31 = Resistor: Manufacture: FH; Part Number: RS-03K2262FT; Footprint size: 0603; ComponentLink1Description: New link; ComponentLink1URL: *; Supplier: LCSC; Supplier Part Number: C304721; Link: https://www.lcsc.com/product-detail/C304721.html?spm=wm.fly.bg.0.xh&lcsc_vid=EwNbUgICTlRcBlxXEQRYAgYAFVkLVwZURVRZBVcDFVcxVlNRQVZbVVFeRVlaVjsOAxUeFF5JWBYZEEoKFBINSQcJGk4NBhADEA4cHktXRlhXSQwSGg0%3D
R32 = Resistor: Manufacture: FH; Part Number: RS-03K3242FT; Footprint size: 0603; ComponentLink1Description: New link; ComponentLink1URL: *; Supplier: LCSC; Supplier Part Number: C304734; Link: https://www.lcsc.com/product-detail/C304734.html?spm=wm.fly.bg.2.xh&lcsc_vid=EwNbUgICTlRcBlxXEQRYAgYAFVkLVwZURVRZBVcDFVcxVlNRQVZbU1FfQlVZVjsOAxUeFF5JWBYZEEoKFBINSQcJGk4NBhADEA4cHktXRlhXSQwSGg0%3D
R33 = Resistor: Manufacture: VISHAY; Part Number: CRCW0603470RJNEA; Footprint size: 0603; ComponentLink1Description: New link; ComponentLink1URL: *; Supplier: LCSC; Supplier Part Number: C844367; Link: https://www.lcsc.com/product-detail/C844367.html?spm=wm.fly.bg.1.xh___wm.fly.tp.1.ml&lcsc_vid=RFYMBlMFQAQLUVJeFVJZXwVeRFYIAgBXEVkPUlxRRVUxVlNRQVdbX1ZUQVNZXzsOAxUeFF5JWBYZEEoBGA4JCwFIFA4DSA%3D%3D
R34 = Resistor: as R24 on sheet CONNECTORS; Footprint size: 0603; ComponentLink1Description: New link; ComponentLink1URL: *; Supplier: LCSC; Supplier Part Number: C114683; Link: https://www.lcsc.com/product-detail/C114683.html
U7 = TPS54331DR: 3.5V to 28V Input, 3A, 570kHz Step-Down Converter with Eco-mode; Manufacture: TI; Part Number: TPS54331DR; Footprint size: SOIC-8; Supplier Part Number: C9865; Supplier: LCSC; Link: https://www.lcsc.com/product-detail/C9865.html?s_z=n_q_TPS54331DR&spm=wm.ssy.bg.0.xh&lcsc_vid=RFYMBlMFQAQLUVJeFVJZXwVeRFYIAgBXEVkPUlxRRVUxVlNRQFJZVVdfQlFbUzsOAxUeFF5JWBYZEEoKFBINSQcJGk4eFQsCAgIaSgADAwAHC0slRlJfVFdSWQkaCgg%3D
VR1 = LM1117IMPX-3.3/NOPB: 800-mA 15-V linear voltage regulator; Manufacture: TI; Part Number: LM1117IMPX-3.3/NOPB; Footprint size: SOT-223; Supplier: LCSC; Supplier Part Number: C23984; Link: https://www.lcsc.com/product-detail/C23984.html?s_z=n_q_LM1117IMPX-3.3%252FNOPB&spm=wm.fly.bg.0.xh&lcsc_vid=RFYMBlMFQAQLUVJeFVJZXwVeRFYIAgBXEVkPUlxRRVUxVlNRT1BZUlZeT1FeVzsOAxUeFF5JWBYZEEoKFBINSQcJGk4eFQsCAgIaSgADAwAHC0slRFleVl1eWQkaCgg%3D

## Nets that join several sheets
3V3: ESP32 (7 pins), XIAO_S3 (J2.1), USB_HUB (20 pins), REALY_AND_PRESSURE (U6.4), CONNECTORS (5 pins), Power (C35.2 R34.1 VR1.2)
5V: ESP32 (C1.2 D1.1), XIAO_S3 (J1.1 X1.14), MOTOR_DRIVERS (6 pins), REALY_AND_PRESSURE (D7.1 K1.2 K1.5), CONNECTORS (ID1.25), Power (7 pins)
19V: MOTOR_DRIVERS (C5.1 C7.1 U3.8 U4.8), REALY_AND_PRESSURE (J5.2), CONNECTORS (ID1.14), Power (C29.2 C30.2 R28.1 U7.2)
GND: ESP32 (32 pins), XIAO_S3 (J1.3 J2.3 X1.13 X1.27), MOTOR_DRIVERS (10 pins), USB_HUB (24 pins), REALY_AND_PRESSURE (5 pins), CONNECTORS (ID1.23 ID1.27 ID1.28 ID1.30), Power (16 pins)
VBUS: ESP32 (6 pins), USB_HUB (C13.2 R9.1)
BL_1: ESP32 (U1.8), CONNECTORS (ID1.9)
BL_2: ESP32 (U1.9), CONNECTORS (ID1.7)
BLE_LED: ESP32 (U1.11), XIAO_S3 (R35.2)
ESP1_D_N: ESP32 (R41.1), USB_HUB (U5.1)
ESP1_D_P: ESP32 (R40.1), USB_HUB (U5.2)
EXTRA_1: ESP32 (U1.35), CONNECTORS (ID1.17)
EXTRA_2: ESP32 (U1.26), CONNECTORS (ID1.10)
HUB_D_N: ESP32 (R39.2), USB_HUB (U5.30)
HUB_D_P: ESP32 (R38.2), USB_HUB (U5.31)
LED_RING: ESP32 (U1.10), CONNECTORS (ID1.5)
LED_STRIP: ESP32 (U1.30), CONNECTORS (ID1.26)
LIFT_DIR: ESP32 (U1.19), MOTOR_DRIVERS (U3.16)
LIFT_EN: ESP32 (U1.7), MOTOR_DRIVERS (U3.9)
LIFT_STEP: ESP32 (U1.18), MOTOR_DRIVERS (U3.15)
LIMIT_1: ESP32 (U1.31), CONNECTORS (D8.1 ID1.11)
LIMIT_2: ESP32 (U1.32), CONNECTORS (D9.1 ID1.13)
LIMIT_3: ESP32 (U1.33), CONNECTORS (D10.1 ID1.15)
LIMIT_4: ESP32 (U1.28), CONNECTORS (D11.1 ID1.12)
N_1A: MOTOR_DRIVERS (U4.4), CONNECTORS (ID1.4)
N_1B: MOTOR_DRIVERS (U4.3), CONNECTORS (ID1.2)
N_2A: MOTOR_DRIVERS (U4.5), CONNECTORS (ID1.6)
N_2B: MOTOR_DRIVERS (U4.6), CONNECTORS (ID1.8)
NIMA_DIR: ESP32 (U1.5), MOTOR_DRIVERS (U4.16)
NIMA_EN: ESP32 (U1.6), MOTOR_DRIVERS (U4.9)
NIMA_STEP: ESP32 (U1.4), MOTOR_DRIVERS (U4.15)
PRESSURE_SWITCH: ESP32 (U1.22), REALY_AND_PRESSURE (R23.1 U6.3)
RELAY: ESP32 (U1.20), REALY_AND_PRESSURE (R21.1)
RX_L: ESP32 (R1.1 U1.38), MOTOR_DRIVERS (U3.12)
RX_N: ESP32 (R3.2 U1.25), MOTOR_DRIVERS (U4.12)
SCL: ESP32 (R43.1 U1.17), CONNECTORS (ID1.24)
SDA: ESP32 (R42.1 U1.12), CONNECTORS (ID1.3)
SERVO: ESP32 (U1.23), CONNECTORS (ID1.1)
U_A: ESP32 (U1.21), CONNECTORS (ID1.21)
U_B: ESP32 (U1.34), CONNECTORS (ID1.19)
X_D_N: XIAO_S3 (X1.30), USB_HUB (U5.3)
X_D_P: XIAO_S3 (X1.31), USB_HUB (U5.4)